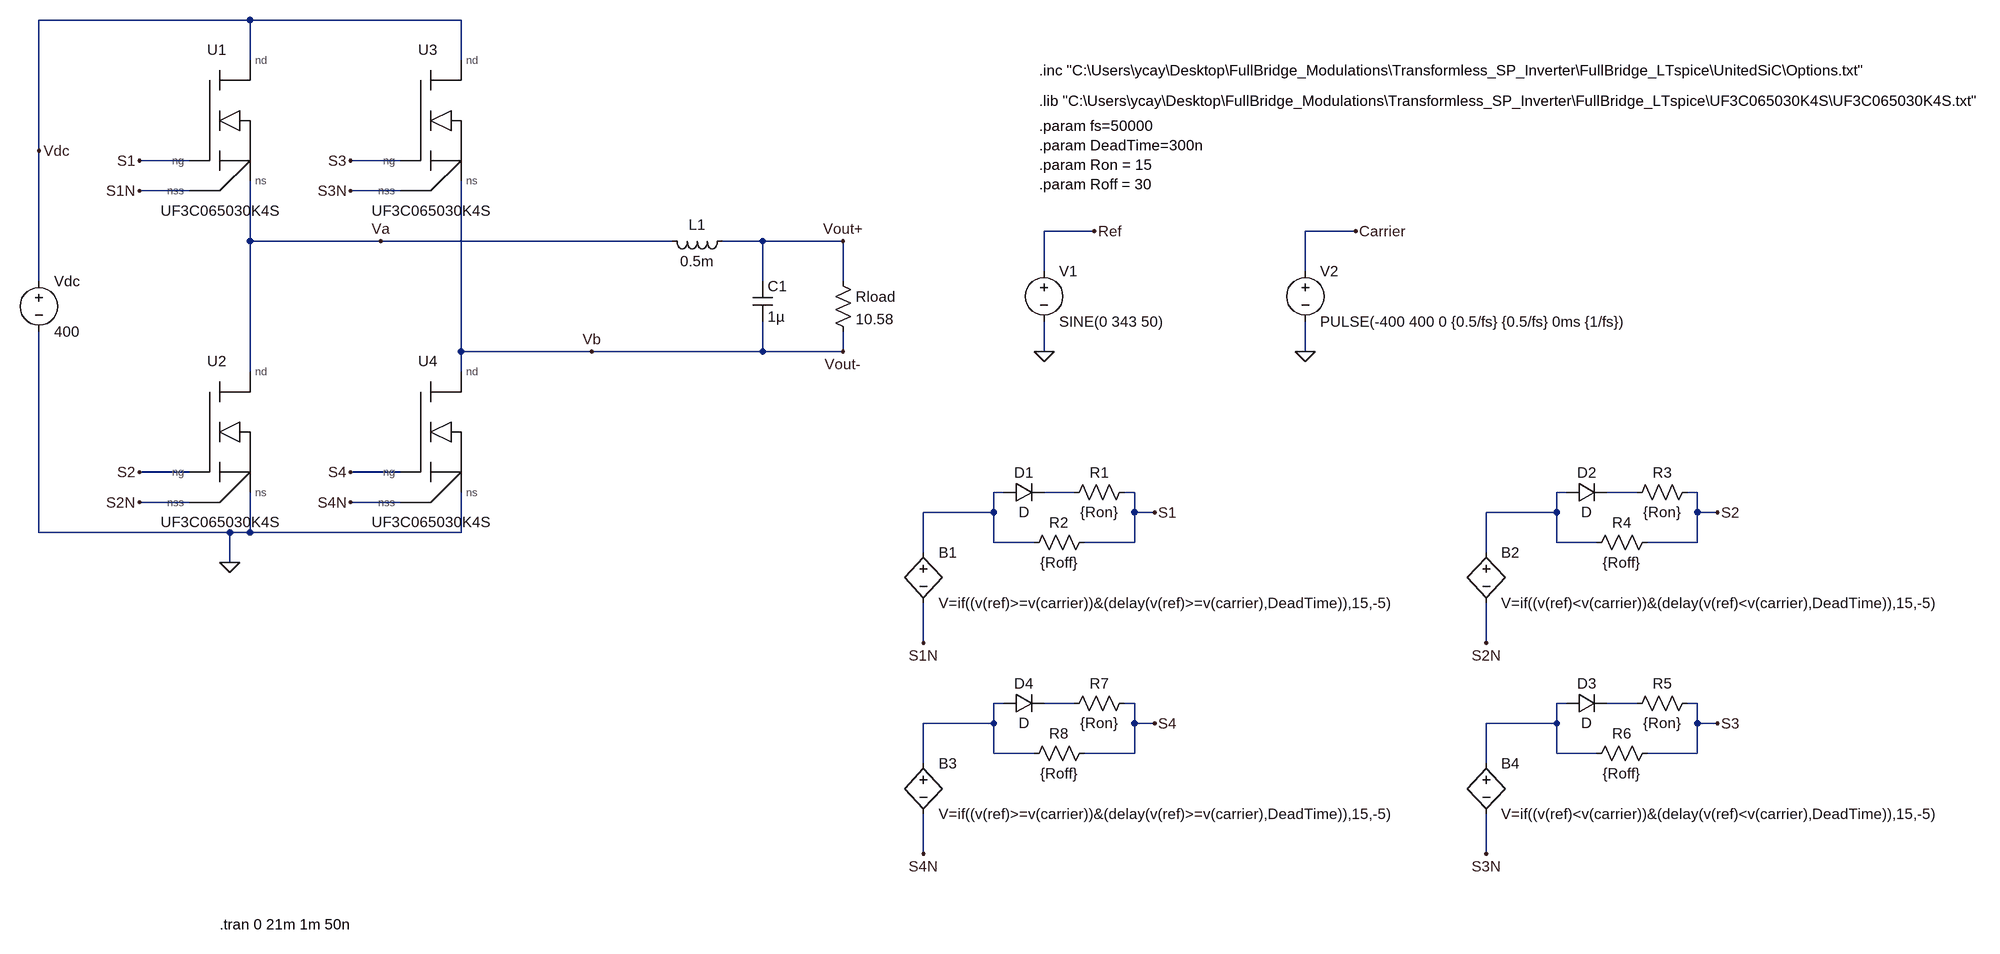
[diagram p0: schematic Bipolar_UF3C065030K4S_DeadTime.asc]
Bipolar_UF3C065030K4S_DeadTime.asc, the LTspice schematic file:
Version 4
SHEET 1 1692 800
WIRE -1216 -656 -1552 -656
WIRE -880 -656 -1216 -656
WIRE -1216 -592 -1216 -656
WIRE -880 -592 -880 -656
WIRE -1552 -448 -1552 -656
WIRE -1312 -432 -1392 -432
WIRE -976 -432 -1056 -432
WIRE -1312 -384 -1392 -384
WIRE -976 -384 -1056 -384
WIRE 128 -320 48 -320
WIRE 544 -320 464 -320
WIRE -1216 -304 -1216 -400
WIRE -1008 -304 -1216 -304
WIRE -544 -304 -1008 -304
WIRE -400 -304 -464 -304
WIRE -272 -304 -400 -304
WIRE 48 -256 48 -320
WIRE 464 -256 464 -320
WIRE -1552 -240 -1552 -448
WIRE -400 -240 -400 -304
WIRE -272 -240 -272 -304
WIRE -880 -128 -880 -400
WIRE -672 -128 -880 -128
WIRE -400 -128 -400 -176
WIRE -400 -128 -672 -128
WIRE -272 -128 -272 -160
WIRE -272 -128 -400 -128
WIRE 48 -128 48 -176
WIRE 464 -128 464 -176
WIRE -1216 -96 -1216 -304
WIRE -880 -96 -880 -128
WIRE -1312 64 -1392 64
WIRE -976 64 -1056 64
WIRE -16 96 -32 96
WIRE 96 96 48 96
WIRE 192 96 176 96
WIRE 880 96 864 96
WIRE 992 96 944 96
WIRE 1088 96 1072 96
WIRE -1312 112 -1392 112
WIRE -976 112 -1056 112
WIRE -32 128 -32 96
WIRE -32 128 -144 128
WIRE 192 128 192 96
WIRE 224 128 192 128
WIRE 864 128 864 96
WIRE 864 128 752 128
WIRE 1088 128 1088 96
WIRE 1120 128 1088 128
WIRE -1552 160 -1552 -160
WIRE -1248 160 -1552 160
WIRE -1216 160 -1216 96
WIRE -1216 160 -1248 160
WIRE -880 160 -880 96
WIRE -880 160 -1216 160
WIRE -32 176 -32 128
WIRE 32 176 -32 176
WIRE 192 176 192 128
WIRE 192 176 112 176
WIRE 864 176 864 128
WIRE 928 176 864 176
WIRE 1088 176 1088 128
WIRE 1088 176 1008 176
WIRE -144 192 -144 128
WIRE 752 192 752 128
WIRE -1248 208 -1248 160
WIRE -144 336 -144 272
WIRE 752 336 752 272
WIRE -16 432 -32 432
WIRE 96 432 48 432
WIRE 192 432 176 432
WIRE 880 432 864 432
WIRE 992 432 944 432
WIRE 1088 432 1072 432
WIRE -32 464 -32 432
WIRE -32 464 -144 464
WIRE 192 464 192 432
WIRE 224 464 192 464
WIRE 864 464 864 432
WIRE 864 464 752 464
WIRE 1088 464 1088 432
WIRE 1120 464 1088 464
WIRE -32 512 -32 464
WIRE 32 512 -32 512
WIRE 192 512 192 464
WIRE 192 512 112 512
WIRE 864 512 864 464
WIRE 928 512 864 512
WIRE 1088 512 1088 464
WIRE 1088 512 1008 512
WIRE -144 528 -144 464
WIRE 752 528 752 464
WIRE -144 672 -144 608
WIRE 752 672 752 608
FLAG 48 -128 0
FLAG 128 -320 Ref
FLAG 464 -128 0
FLAG 544 -320 Carrier
FLAG 224 128 S1
FLAG 1120 128 S2
FLAG -1248 208 0
FLAG -272 -304 Vout+
FLAG -272 -128 Vout-
FLAG -144 336 S1N
FLAG 752 336 S2N
FLAG 224 464 S4
FLAG -144 672 S4N
FLAG 1120 464 S3
FLAG 752 672 S3N
FLAG -1392 -432 S1
FLAG -1392 -384 S1N
FLAG -1056 64 S4
FLAG -1056 112 S4N
FLAG -1392 64 S2
FLAG -1392 112 S2N
FLAG -1056 -432 S3
FLAG -1056 -384 S3N
FLAG -1552 -448 Vdc
FLAG -1008 -304 Va
FLAG -672 -128 Vb
SYMBOL voltage 48 -272 R0
WINDOW 123 0 0 Left 0
WINDOW 39 0 0 Left 0
SYMATTR InstName V1
SYMATTR Value SINE(0 343 50)
SYMBOL voltage 464 -272 R0
WINDOW 123 0 0 Left 0
WINDOW 39 0 0 Left 0
SYMATTR InstName V2
SYMATTR Value PULSE(-400 400 0 {0.5/fs} {0.5/fs} 0ms {1/fs})
SYMBOL bv -144 176 R0
SYMATTR InstName B1
SYMATTR Value V=if((v(ref)>=v(carrier))&(delay(v(ref)>=v(carrier),DeadTime)),15,-5)
SYMBOL bv 752 176 R0
SYMATTR InstName B2
SYMATTR Value V=if((v(ref)<v(carrier))&(delay(v(ref)<v(carrier),DeadTime)),15,-5)
SYMBOL ind -448 -320 R90
WINDOW 0 5 56 VBottom 2
WINDOW 3 32 56 VTop 2
SYMATTR InstName L1
SYMATTR Value 0.5m
SYMATTR SpiceLine Rser=30m
SYMBOL res -288 -256 R0
SYMATTR InstName Rload
SYMATTR Value 10.58
SYMBOL voltage -1552 -256 R0
WINDOW 123 0 0 Left 0
WINDOW 39 0 0 Left 0
SYMATTR InstName Vdc
SYMATTR Value 400
SYMBOL cap -416 -240 R0
SYMATTR InstName C1
SYMATTR Value 1µ
SYMATTR SpiceLine Rser=0.11m
SYMBOL res 192 80 R90
WINDOW 0 0 56 VBottom 2
WINDOW 3 32 56 VTop 2
SYMATTR InstName R1
SYMATTR Value {Ron}
SYMBOL diode -16 112 R270
WINDOW 0 32 32 VTop 2
WINDOW 3 0 32 VBottom 2
SYMATTR InstName D1
SYMBOL res 128 160 R90
WINDOW 0 0 56 VBottom 2
WINDOW 3 32 56 VTop 2
SYMATTR InstName R2
SYMATTR Value {Roff}
SYMBOL bv -144 512 R0
SYMATTR InstName B3
SYMATTR Value V=if((v(ref)>=v(carrier))&(delay(v(ref)>=v(carrier),DeadTime)),15,-5)
SYMBOL bv 752 512 R0
SYMATTR InstName B4
SYMATTR Value V=if((v(ref)<v(carrier))&(delay(v(ref)<v(carrier),DeadTime)),15,-5)
SYMBOL res 1088 80 R90
WINDOW 0 0 56 VBottom 2
WINDOW 3 32 56 VTop 2
SYMATTR InstName R3
SYMATTR Value {Ron}
SYMBOL diode 880 112 R270
WINDOW 0 32 32 VTop 2
WINDOW 3 0 32 VBottom 2
SYMATTR InstName D2
SYMBOL res 1024 160 R90
WINDOW 0 0 56 VBottom 2
WINDOW 3 32 56 VTop 2
SYMATTR InstName R4
SYMATTR Value {Roff}
SYMBOL res 1088 416 R90
WINDOW 0 0 56 VBottom 2
WINDOW 3 32 56 VTop 2
SYMATTR InstName R5
SYMATTR Value {Ron}
SYMBOL diode 880 448 R270
WINDOW 0 32 32 VTop 2
WINDOW 3 0 32 VBottom 2
SYMATTR InstName D3
SYMBOL res 1024 496 R90
WINDOW 0 0 56 VBottom 2
WINDOW 3 32 56 VTop 2
SYMATTR InstName R6
SYMATTR Value {Roff}
SYMBOL res 192 416 R90
WINDOW 0 0 56 VBottom 2
WINDOW 3 32 56 VTop 2
SYMATTR InstName R7
SYMATTR Value {Ron}
SYMBOL diode -16 448 R270
WINDOW 0 32 32 VTop 2
WINDOW 3 0 32 VBottom 2
SYMATTR InstName D4
SYMBOL res 128 496 R90
WINDOW 0 0 56 VBottom 2
WINDOW 3 32 56 VTop 2
SYMATTR InstName R8
SYMATTR Value {Roff}
SYMBOL AutoGenerated\\UF3C065030K4S -1264 -496 R0
SYMATTR InstName U1
SYMBOL AutoGenerated\\UF3C065030K4S -1264 0 R0
SYMATTR InstName U2
SYMBOL AutoGenerated\\UF3C065030K4S -928 -496 R0
SYMATTR InstName U3
SYMBOL AutoGenerated\\UF3C065030K4S -928 0 R0
SYMATTR InstName U4
TEXT 40 -488 Left 2 !.param fs=50000\n.param DeadTime=300n\n.param Ron = 15\n.param Roff = 30
TEXT 40 -528 Left 2 !.lib "C:\\Users\\ycay\\Desktop\\FullBridge_Modulations\\Transformless_SP_Inverter\\FullBridge_LTspice\\UF3C065030K4S\\UF3C065030K4S.txt"
TEXT 40 -576 Left 2 !.inc "C:\\Users\\ycay\\Desktop\\FullBridge_Modulations\\Transformless_SP_Inverter\\FullBridge_LTspice\\UnitedSiC\\Options.txt"
TEXT -1264 784 Left 2 !.tran 0 21m 1m 50n

The netlist it stands for:
* Bipolar_UF3C065030K4S_DeadTime.asc
V1 Ref 0 SINE(0 343 50)
V2 Carrier 0 PULSE(-400 400 0 {0.5/fs} {0.5/fs} 0ms {1/fs})
B1 N001 S1N V=if((v(ref)>=v(carrier))&(delay(v(ref)>=v(carrier),DeadTime)),15,-5)
B2 N003 S2N V=if((v(ref)<v(carrier))&(delay(v(ref)<v(carrier),DeadTime)),15,-5)
L1 Vout+ Va 0.5m Rser=30m
Rload Vout+ Vb 10.58
Vdc Vdc 0 400
C1 Vout+ Vb 1µ Rser=0.11m
R1 S1 N002 {Ron}
D1 N001 N002 D
R2 S1 N001 {Roff}
B3 N005 S4N V=if((v(ref)>=v(carrier))&(delay(v(ref)>=v(carrier),DeadTime)),15,-5)
B4 N007 S3N V=if((v(ref)<v(carrier))&(delay(v(ref)<v(carrier),DeadTime)),15,-5)
R3 S2 N004 {Ron}
D2 N003 N004 D
R4 S2 N003 {Roff}
R5 S3 N008 {Ron}
D3 N007 N008 D
R6 S3 N007 {Roff}
R7 S4 N006 {Ron}
D4 N005 N006 D
R8 S4 N005 {Roff}
XU1 Vdc S1 Va S1N UF3C065030K4S  ; pins nd ng ns nss
XU2 Va S2 0 S2N UF3C065030K4S  ; pins nd ng ns nss
XU3 Vdc S3 Vb S3N UF3C065030K4S  ; pins nd ng ns nss
XU4 Vb S4 0 S4N UF3C065030K4S  ; pins nd ng ns nss
.model D D
.lib standard.dio
.param fs=50000
.param DeadTime=300n
.param Ron = 15
.param Roff = 30
.lib "C:\Users\ycay\Desktop\FullBridge_Modulations\Transformless_SP_Inverter\FullBridge_LTspice\UF3C065030K4S\UF3C065030K4S.txt"
.inc "C:\Users\ycay\Desktop\FullBridge_Modulations\Transformless_SP_Inverter\FullBridge_LTspice\UnitedSiC\Options.txt"
.tran 0 21m 1m 50n
.lib C:\Users\ycay\Desktop\FullBridge_Modulations\Transformless_SP_Inverter\FullBridge_LTspice\UF3C065030K4S\UF3C065030K4S.txt
.backanno
.end